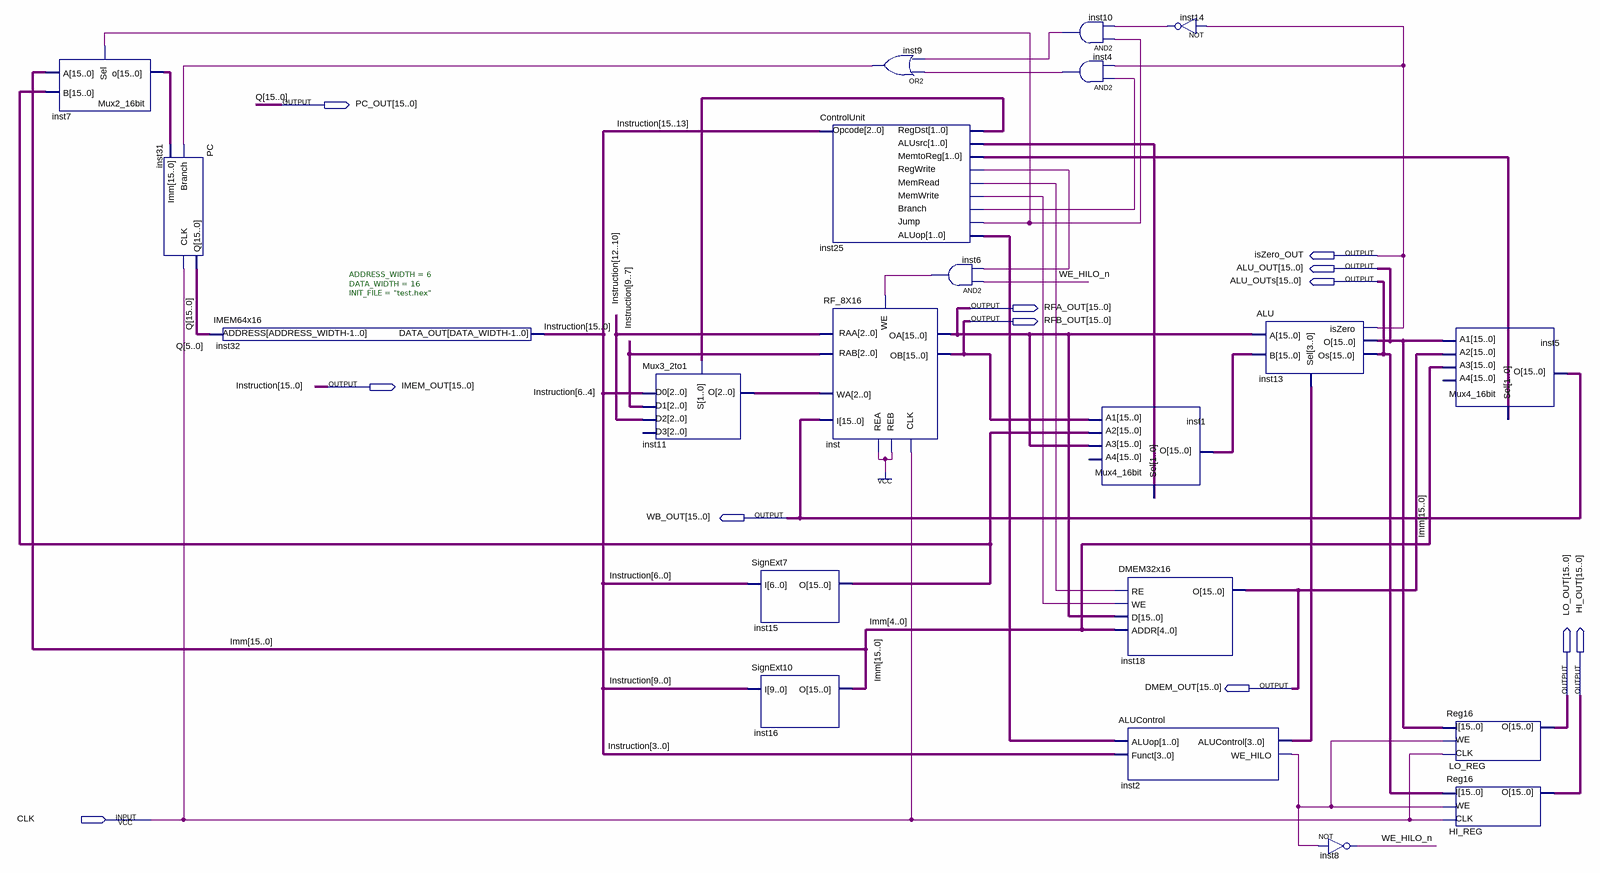
[diagram p0: schematic sheet]
// Quartus schematic CPUTopDesign_datt_test.bdf as structural Verilog: 21 symbols, 12 pins
module CPUTopDesign_datt_test (
  input  CLK,
  output [15:0] PC_OUT,
  output isZero_OUT,
  output [15:0] ALU_OUT,
  output [15:0] ALU_OUTs,
  output [15:0] RFA_OUT,
  output [15:0] RFB_OUT,
  output [15:0] IMEM_OUT,
  output [15:0] WB_OUT,
  output [15:0] DMEM_OUT,
  output [15:0] LO_OUT,
  output [15:0] HI_OUT
);

  wire inst2_we_hilo, inst4_out, inst6_out, inst9_out, inst10_out, inst14_out, inst25_branch, inst25_jump,
       inst25_memread, inst25_memwrite, inst25_regwrite, WE_HILO_n;
  wire [1:0] inst25_aluop, inst25_alusrc, inst25_memtoreg, inst25_regdst;
  wire [2:0] inst11_o;
  wire [3:0] inst2_alucontrol;
  wire [15:0] Imm, inst1_o, inst7_o, inst15_o;

  Mux2_16bit inst7 (.Sel(inst25_jump), .A(Imm), .B(inst15_o), .o(inst7_o));
  PC inst31 (.Branch(inst9_out), .Imm(inst7_o), .CLK(CLK), .Q(PC_OUT));
  IMEM64x16 #(.ADDRESS_WIDTH(6), .DATA_WIDTH(16), .INIT_FILE("test.hex")) inst32 (
    .ADDRESS(PC_OUT[5:0]), .DATA_OUT(IMEM_OUT));
  Mux3_2to1 inst11 (
    .D0(IMEM_OUT[6:4]), .D1(IMEM_OUT[9:7]), .D2(IMEM_OUT[12:10]), .S(inst25_regdst), .O(inst11_o));  // open: D3
  SignExt7 inst15 (.I(IMEM_OUT[6:0]), .O(inst15_o));
  SignExt10 inst16 (.I(IMEM_OUT[9:0]), .O(Imm));
  ControlUnit inst25 (
    .Opcode(IMEM_OUT[15:13]), .RegDst(inst25_regdst), .ALUsrc(inst25_alusrc), .MemtoReg(inst25_memtoreg),
    .RegWrite(inst25_regwrite), .MemRead(inst25_memread), .MemWrite(inst25_memwrite), .Branch(inst25_branch),
    .Jump(inst25_jump), .ALUop(inst25_aluop));
  RF_8X16 inst (
    .I(WB_OUT), .WA(inst11_o), .WE(inst6_out), .RAA(IMEM_OUT[12:10]), .REA(1'b1), .RAB(IMEM_OUT[9:7]),
    .REB(1'b1), .CLK(CLK), .OB(RFB_OUT), .OA(RFA_OUT));
  or inst9 (inst9_out, inst4_out, inst10_out);
  and inst6 (inst6_out, WE_HILO_n, inst25_regwrite);
  and inst10 (inst10_out, inst25_jump, inst14_out);
  and inst4 (inst4_out, inst25_branch, isZero_OUT);
  Mux4_16bit inst1 (.Sel(inst25_alusrc), .A3(RFA_OUT), .A2(inst15_o), .A1(RFB_OUT), .O(inst1_o));  // open: A4
  DMEM32x16 inst18 (.RE(inst25_memread), .WE(inst25_memwrite), .D(RFA_OUT), .ADDR(Imm), .O(DMEM_OUT));
  ALUControl inst2 (
    .ALUop(inst25_aluop), .Funct(IMEM_OUT[3:0]), .ALUControl(inst2_alucontrol), .WE_HILO(inst2_we_hilo));
  not inst14 (inst14_out, isZero_OUT);
  ALU inst13 (.Sel(inst2_alucontrol), .A(RFA_OUT), .B(inst1_o), .O(ALU_OUT), .Os(ALU_OUTs), .isZero(isZero_OUT));
  not inst8 (WE_HILO_n, inst2_we_hilo);
  Mux4_16bit inst5 (.Sel(inst25_memtoreg), .A3(Imm), .A2(DMEM_OUT), .A1(ALU_OUT), .O(WB_OUT));  // open: A4
  Reg16 LO_REG (.WE(inst2_we_hilo), .CLK(CLK), .I(ALU_OUT), .O(LO_OUT));
  Reg16 HI_REG (.WE(inst2_we_hilo), .CLK(CLK), .I(ALU_OUTs), .O(HI_OUT));

  // Other names for the same wires on the sheet: Instruction[15:0] = IMEM_OUT; Q[15:0] = PC_OUT
endmodule
